# Altium project HIL_RIG_Hardware.PrjPcb (part 1 of 11)
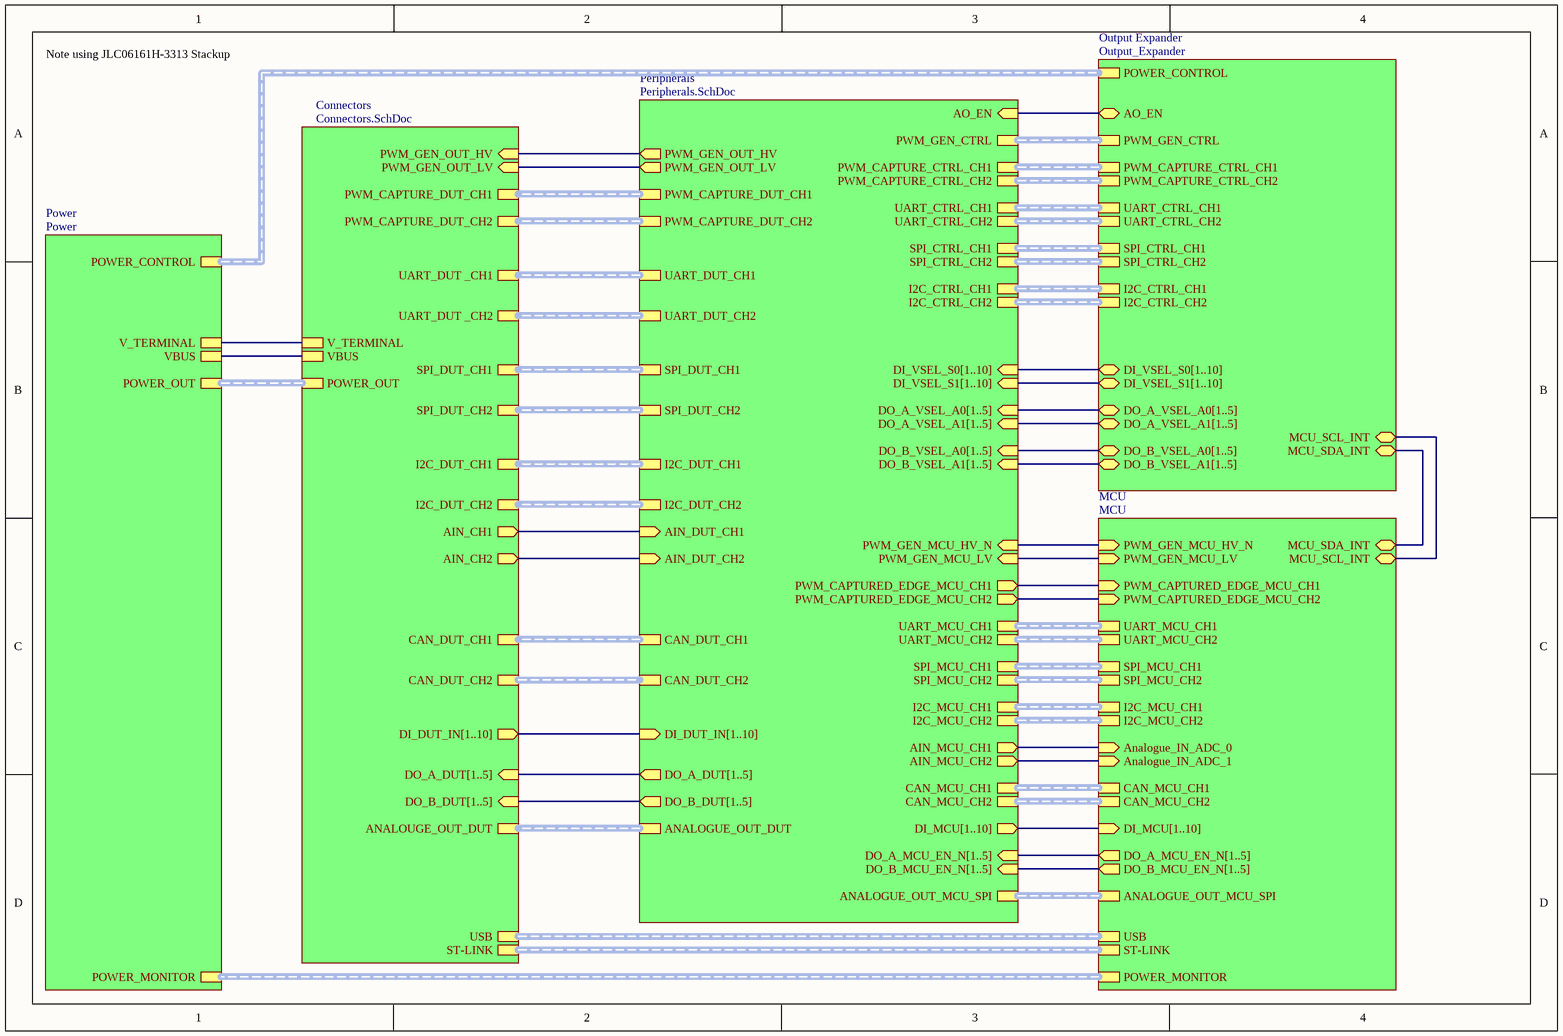
[diagram p0:  Top_Level_HIL_RIG.SchDoc]
29 sheets, 677 parts. Net scope: hierarchical (ports join the sheet entries above them; power ports are global).
Board file:  HIL_RIG_REV_1_2.PcbDoc
Sheets:
   Top_Level_HIL_RIG.SchDoc
   MCU.SchDoc
   PWM_CAPTURE_VREF.SchDoc
   Peripherals.SchDoc
   Digital_Input.SchDoc
   Power.SchDoc
   Digital_Output.SchDoc
   PWM_Input.SchDoc
   PWM_Output.SchDoc
   Analogue_Input.SchDoc
   Analogue_Output.SchDoc
   CAN.SchDoc
   SPI.SchDoc
   UART.SchDoc
   External_Flash.SchDoc
   Connectors.SchDoc
   24V.SchDoc
   12V.SchDoc
   5V.SchDoc
   3V3_Smooth.SchDoc
   3V3_High_Current.SchDoc
   Output_Expander.SchDoc
   I2C.SchDoc
   Output_Expander_IC.SchDoc
   Led_Green_Direct.SchDoc
   LED_Orange_Direct.SchDoc
   LED_Green_Direct_ActiveLow.SchDoc
   LED_RED_Direct_BRIGHT.SchDoc
   LED_Blue_Direct_BRIGHT.SchDoc

## Sheet  Top_Level_HIL_RIG.SchDoc
size A4; SheetNumber: 1; SheetTotal: 29

### Sub-sheets
Connectors = Connectors.SchDoc (file not in this document): V_TERMINAL, VBUS, POWER_OUT (harness Power_Out), PWM_CAPTURE_DUT_CH2 (harness PWM_CAPTURE_DUT_SIGNALS), UART_DUT _CH1 (harness UART_DUT_SIGNALS), CAN_DUT_CH1 (harness CAN_DIFFERENTIAL), CAN_DUT_CH2 (harness CAN_DIFFERENTIAL), DI_DUT_IN[1..10] (out), AIN_CH1 (out), AIN_CH2 (out), SPI_DUT_CH2 (harness SPI_DUT_SIGNALS), SPI_DUT_CH1 (harness SPI_DUT_SIGNALS), I2C_DUT_CH1 (harness I2C_DUT_SIGNALS), I2C_DUT_CH2 (harness I2C_DUT_SIGNALS), UART_DUT _CH2 (harness UART_DUT_SIGNALS), PWM_CAPTURE_DUT_CH1 (harness PWM_CAPTURE_DUT_SIGNALS), PWM_GEN_OUT_LV (in), PWM_GEN_OUT_HV (in), USB (harness USB), ST-LINK (harness ST-LINK), DO_A_DUT[1..5] (in), DO_B_DUT[1..5] (in), ANALOUGE_OUT_DUT (harness ANALOUGE_OUT_DUT_SIGNALS)
MCU = MCU (file not in this document): USB (harness USB), ST-LINK (harness ST-LINK), POWER_MONITOR (harness Power_Monitor), UART_MCU_CH1 (harness UART_MCU_SIGNALS), UART_MCU_CH2 (harness UART_MCU_SIGNALS), DI_MCU[1..10] (in), DO_A_MCU_EN_N[1..5] (out), DO_B_MCU_EN_N[1..5] (out), MCU_SDA_INT (bidir), MCU_SCL_INT (bidir), SPI_MCU_CH1 (harness SPI_MCU_SIGNALS), SPI_MCU_CH2 (harness SPI_MCU_SIGNALS), PWM_GEN_MCU_HV_N (in), PWM_GEN_MCU_LV (in), PWM_CAPTURED_EDGE_MCU_CH1 (in), PWM_CAPTURED_EDGE_MCU_CH2 (in), Analogue_IN_ADC_0 (in), Analogue_IN_ADC_1 (in), CAN_MCU_CH1 (harness CAN_TX_RX), CAN_MCU_CH2 (harness CAN_TX_RX), I2C_MCU_CH1 (harness I2C_MCU_SIGNALS), I2C_MCU_CH2 (harness I2C_MCU_SIGNALS), ANALOGUE_OUT_MCU_SPI (harness ANALOGUE_OUT_MCU_SIGNALS)
Output Expander = Output_Expander (file not in this document): DO_B_VSEL_A1[1..5] (bidir), DO_B_VSEL_A0[1..5] (bidir), DO_A_VSEL_A0[1..5] (bidir), DO_A_VSEL_A1[1..5] (bidir), DI_VSEL_S0[1..10] (bidir), DI_VSEL_S1[1..10] (bidir), PWM_GEN_CTRL (harness PWM_GEN_CTRL_SIGNALS), POWER_CONTROL (harness Power_Ctl), PWM_CAPTURE_CTRL_CH1 (harness PWM_CAPTURE_CTRL_SIGNALS), PWM_CAPTURE_CTRL_CH2 (harness PWM_CAPTURE_CTRL_SIGNALS), MCU_SCL_INT (bidir), MCU_SDA_INT (bidir), SPI_CTRL_CH1 (harness SPI_CTRL_SIGNALS), SPI_CTRL_CH2 (harness SPI_CTRL_SIGNALS), UART_CTRL_CH1 (harness UART_CTRL_SIGNALS), UART_CTRL_CH2 (harness UART_CTRL_SIGNALS), I2C_CTRL_CH1 (harness I2C_CTRL_SIGNALS), I2C_CTRL_CH2 (harness I2C_CTRL_SIGNALS), AO_EN (bidir)
Peripherals = Peripherals.SchDoc (file not in this document): PWM_CAPTURE_DUT_CH2 (harness PWM_CAPTURE_DUT_SIGNALS), UART_DUT_CH1 (harness UART_DUT_SIGNALS), UART_DUT_CH2 (harness UART_DUT_SIGNALS), SPI_DUT_CH2 (harness SPI_DUT_SIGNALS), SPI_DUT_CH1 (harness SPI_DUT_SIGNALS), I2C_DUT_CH2 (harness I2C_DUT_SIGNALS), I2C_DUT_CH1 (harness I2C_DUT_SIGNALS), AIN_DUT_CH1 (in), AIN_DUT_CH2 (in), CAN_DUT_CH1 (harness CAN_DIFFERENTIAL), CAN_DUT_CH2 (harness CAN_DIFFERENTIAL), DI_DUT_IN[1..10] (in), PWM_GEN_CTRL (harness PWM_GEN_CTRL_SIGNALS), PWM_CAPTURE_CTRL_CH1 (harness PWM_CAPTURE_CTRL_SIGNALS), PWM_CAPTURE_CTRL_CH2 (harness PWM_CAPTURE_CTRL_SIGNALS), UART_CTRL_CH1 (harness UART_CTRL_SIGNALS), UART_CTRL_CH2 (harness UART_CTRL_SIGNALS), SPI_CTRL_CH1 (harness SPI_CTRL_SIGNALS), SPI_CTRL_CH2 (harness SPI_CTRL_SIGNALS), I2C_CTRL_CH1 (harness I2C_CTRL_SIGNALS), I2C_CTRL_CH2 (harness I2C_CTRL_SIGNALS), PWM_CAPTURE_DUT_CH1 (harness PWM_CAPTURE_DUT_SIGNALS), PWM_GEN_OUT_LV (out), PWM_GEN_OUT_HV (out), DO_A_DUT[1..5] (out), DO_B_DUT[1..5] (out), CAN_MCU_CH2 (harness CAN_TX_RX), CAN_MCU_CH1 (harness CAN_TX_RX), AIN_MCU_CH2 (out), AIN_MCU_CH1 (out), I2C_MCU_CH2 (harness I2C_MCU_SIGNALS), I2C_MCU_CH1 (harness I2C_MCU_SIGNALS), ANALOGUE_OUT_DUT, AO_EN (in), SPI_MCU_CH2 (harness SPI_MCU_SIGNALS), SPI_MCU_CH1 (harness SPI_MCU_SIGNALS), UART_MCU_CH2 (harness UART_MCU_SIGNALS), UART_MCU_CH1 (harness UART_MCU_SIGNALS), PWM_CAPTURED_EDGE_MCU_CH2 (out), PWM_CAPTURED_EDGE_MCU_CH1 (out), PWM_GEN_MCU_LV (in), PWM_GEN_MCU_HV_N (in), ANALOGUE_OUT_MCU_SPI, DI_VSEL_S0[1..10] (in), DI_VSEL_S1[1..10] (in), DO_A_VSEL_A0[1..5] (in), DO_A_VSEL_A1[1..5] (in), DO_B_VSEL_A0[1..5] (in), DO_B_VSEL_A1[1..5] (in), DI_MCU[1..10] (out), DO_A_MCU_EN_N[1..5] (in), DO_B_MCU_EN_N[1..5] (in)
Power = Power (file not in this document): V_TERMINAL, VBUS, POWER_OUT (harness *), POWER_CONTROL (harness *), POWER_MONITOR (harness *)

### Nets
(unnamed): sheet MCU/MCU_SDA_INT, sheet Output Expander/MCU_SDA_INT
(unnamed): sheet MCU/MCU_SCL_INT, sheet Output Expander/MCU_SCL_INT
(unnamed): sheet MCU/PWM_GEN_MCU_HV_N, sheet Peripherals/PWM_GEN_MCU_HV_N
(unnamed): sheet MCU/PWM_GEN_MCU_LV, sheet Peripherals/PWM_GEN_MCU_LV
(unnamed): sheet MCU/PWM_CAPTURED_EDGE_MCU_CH1, sheet Peripherals/PWM_CAPTURED_EDGE_MCU_CH1
(unnamed): sheet MCU/PWM_CAPTURED_EDGE_MCU_CH2, sheet Peripherals/PWM_CAPTURED_EDGE_MCU_CH2
(unnamed): sheet MCU/Analogue_IN_ADC_0, sheet Peripherals/AIN_MCU_CH1
(unnamed): sheet MCU/Analogue_IN_ADC_1, sheet Peripherals/AIN_MCU_CH2
(unnamed): sheet Power/V_TERMINAL, sheet Connectors/V_TERMINAL
(unnamed): sheet Power/VBUS, sheet Connectors/VBUS
(unnamed): sheet Peripherals/AIN_DUT_CH1, sheet Connectors/AIN_CH1
(unnamed): sheet Peripherals/AIN_DUT_CH2, sheet Connectors/AIN_CH2
(unnamed): sheet Peripherals/PWM_GEN_OUT_LV, sheet Connectors/PWM_GEN_OUT_LV
(unnamed): sheet Peripherals/PWM_GEN_OUT_HV, sheet Connectors/PWM_GEN_OUT_HV
(unnamed): sheet Peripherals/AO_EN, sheet Output Expander/AO_EN

### Buses and harness runs
bus sheet Connectors/DI_DUT_IN[1..10] = sheet Peripherals/DI_DUT_IN[1..10]
bus sheet Connectors/DO_A_DUT[1..5] = sheet Peripherals/DO_A_DUT[1..5]
bus sheet Connectors/DO_B_DUT[1..5] = sheet Peripherals/DO_B_DUT[1..5]
bus sheet MCU/DI_MCU[1..10] = sheet Peripherals/DI_MCU[1..10]
bus sheet MCU/DO_A_MCU_EN_N[1..5] = sheet Peripherals/DO_A_MCU_EN_N[1..5]
bus sheet MCU/DO_B_MCU_EN_N[1..5] = sheet Peripherals/DO_B_MCU_EN_N[1..5]
bus sheet Output Expander/DI_VSEL_S0[1..10] = sheet Peripherals/DI_VSEL_S0[1..10]
bus sheet Output Expander/DI_VSEL_S1[1..10] = sheet Peripherals/DI_VSEL_S1[1..10]
bus sheet Output Expander/DO_A_VSEL_A0[1..5] = sheet Peripherals/DO_A_VSEL_A0[1..5]
bus sheet Output Expander/DO_A_VSEL_A1[1..5] = sheet Peripherals/DO_A_VSEL_A1[1..5]
bus sheet Output Expander/DO_B_VSEL_A0[1..5] = sheet Peripherals/DO_B_VSEL_A0[1..5]
bus sheet Output Expander/DO_B_VSEL_A1[1..5] = sheet Peripherals/DO_B_VSEL_A1[1..5]
harness  = sheet Connectors/ANALOUGE_OUT_DUT = sheet Peripherals/ANALOGUE_OUT_DUT
harness sheet Connectors/CAN_DUT_CH1 = sheet Peripherals/CAN_DUT_CH1
harness sheet Connectors/CAN_DUT_CH2 = sheet Peripherals/CAN_DUT_CH2
harness sheet Connectors/I2C_DUT_CH1 = sheet Peripherals/I2C_DUT_CH1
harness sheet Connectors/I2C_DUT_CH2 = sheet Peripherals/I2C_DUT_CH2
harness sheet Connectors/POWER_OUT = sheet Power/POWER_OUT
harness sheet Connectors/PWM_CAPTURE_DUT_CH1 = sheet Peripherals/PWM_CAPTURE_DUT_CH1
harness sheet Connectors/PWM_CAPTURE_DUT_CH2 = sheet Peripherals/PWM_CAPTURE_DUT_CH2
harness sheet Connectors/SPI_DUT_CH1 = sheet Peripherals/SPI_DUT_CH1
harness sheet Connectors/SPI_DUT_CH2 = sheet Peripherals/SPI_DUT_CH2
harness sheet Connectors/ST-LINK = sheet MCU/ST-LINK
harness sheet Connectors/UART_DUT _CH1 = sheet Peripherals/UART_DUT_CH1
harness sheet Connectors/UART_DUT _CH2 = sheet Peripherals/UART_DUT_CH2
harness sheet Connectors/USB = sheet MCU/USB
harness sheet MCU/ANALOGUE_OUT_MCU_SPI = sheet Peripherals/ANALOGUE_OUT_MCU_SPI
harness sheet MCU/CAN_MCU_CH1 = sheet Peripherals/CAN_MCU_CH1
harness sheet MCU/CAN_MCU_CH2 = sheet Peripherals/CAN_MCU_CH2
harness sheet MCU/I2C_MCU_CH1 = sheet Peripherals/I2C_MCU_CH1
harness sheet MCU/I2C_MCU_CH2 = sheet Peripherals/I2C_MCU_CH2
harness sheet MCU/POWER_MONITOR = sheet Power/POWER_MONITOR
harness sheet MCU/SPI_MCU_CH1 = sheet Peripherals/SPI_MCU_CH1
harness sheet MCU/SPI_MCU_CH2 = sheet Peripherals/SPI_MCU_CH2
harness sheet MCU/UART_MCU_CH1 = sheet Peripherals/UART_MCU_CH1
harness sheet MCU/UART_MCU_CH2 = sheet Peripherals/UART_MCU_CH2
harness sheet Output Expander/I2C_CTRL_CH1 = sheet Peripherals/I2C_CTRL_CH1
harness sheet Output Expander/I2C_CTRL_CH2 = sheet Peripherals/I2C_CTRL_CH2
harness sheet Output Expander/POWER_CONTROL = sheet Power/POWER_CONTROL
harness sheet Output Expander/PWM_CAPTURE_CTRL_CH1 = sheet Peripherals/PWM_CAPTURE_CTRL_CH1
harness sheet Output Expander/PWM_CAPTURE_CTRL_CH2 = sheet Peripherals/PWM_CAPTURE_CTRL_CH2
harness sheet Output Expander/PWM_GEN_CTRL = sheet Peripherals/PWM_GEN_CTRL
harness sheet Output Expander/SPI_CTRL_CH1 = sheet Peripherals/SPI_CTRL_CH1
harness sheet Output Expander/SPI_CTRL_CH2 = sheet Peripherals/SPI_CTRL_CH2
harness sheet Output Expander/UART_CTRL_CH1 = sheet Peripherals/UART_CTRL_CH1
harness sheet Output Expander/UART_CTRL_CH2 = sheet Peripherals/UART_CTRL_CH2

### Notes on the sheet
- Note using JLC06161H-3313 Stackup

## Sheet  MCU.SchDoc
size A2; SheetNumber: 2; SheetTotal: 29
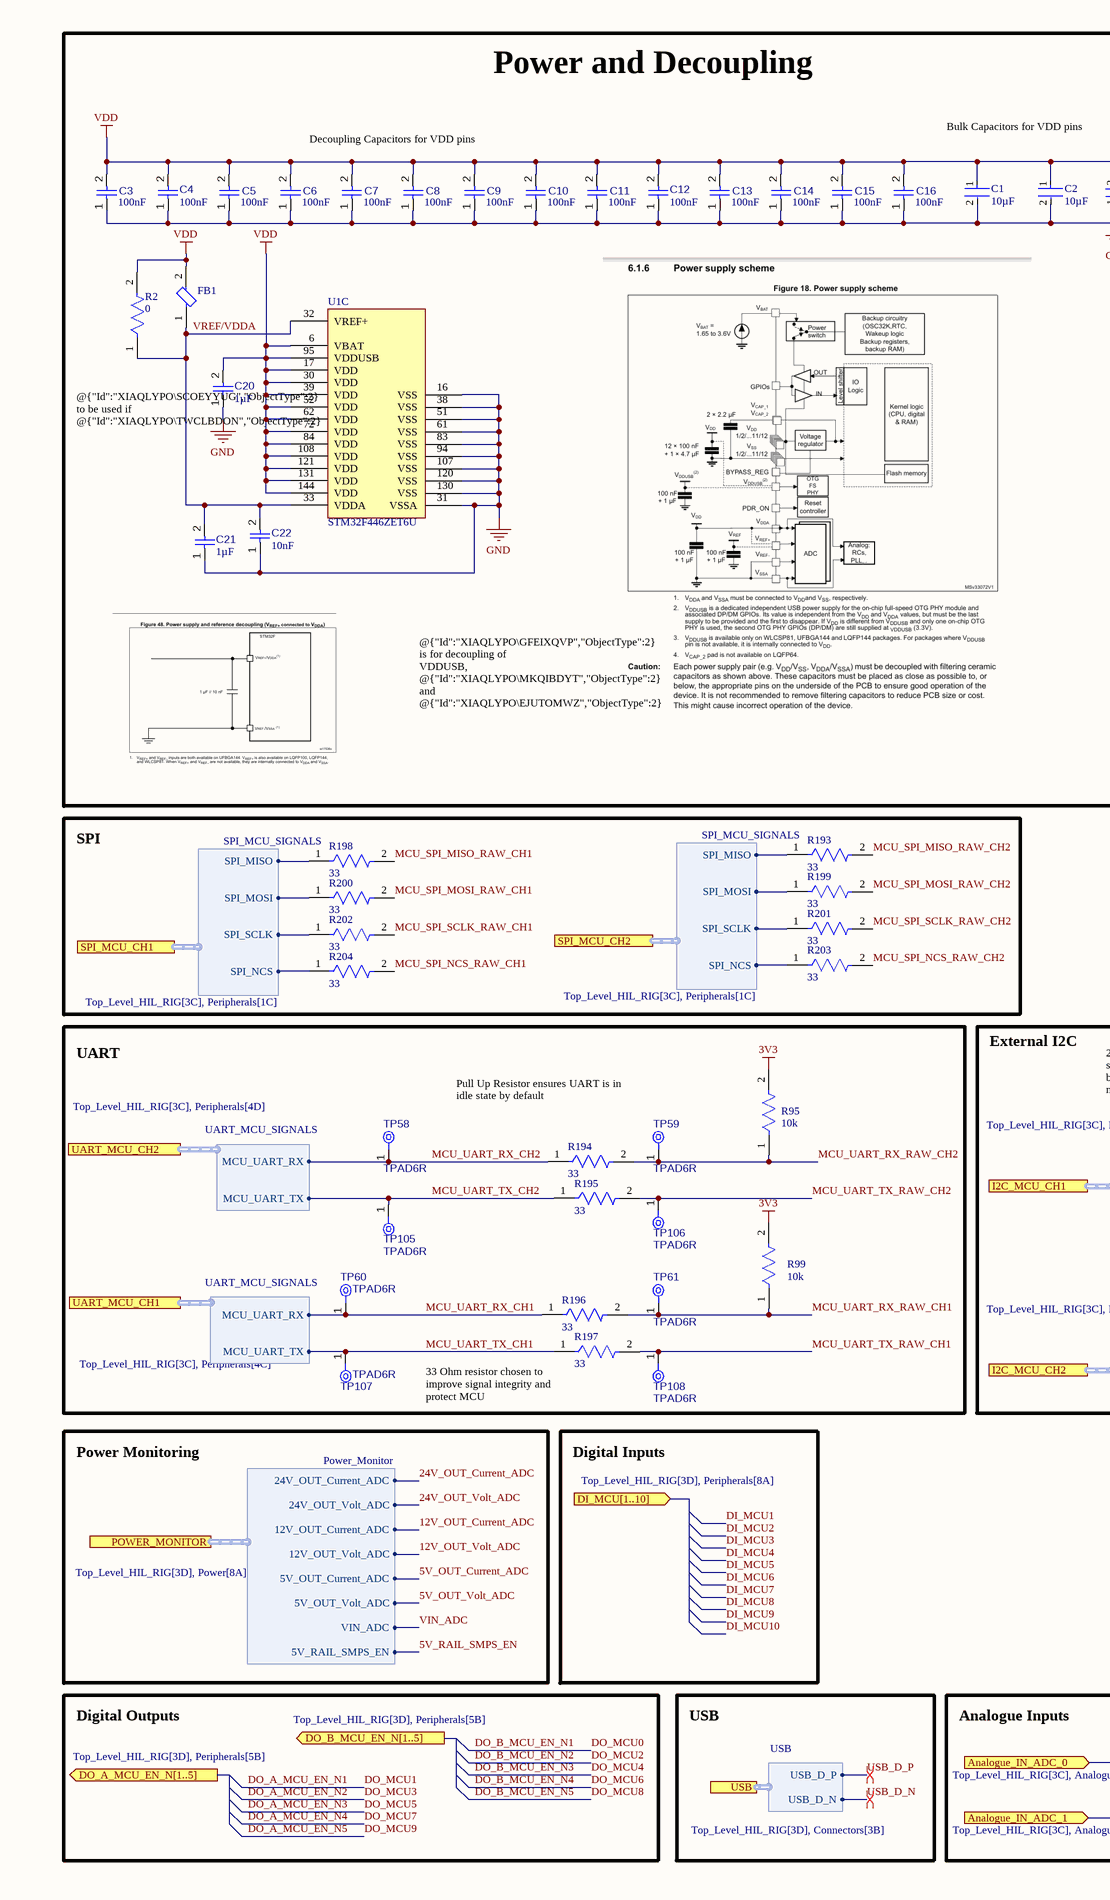
[diagram p1:  MCU.SchDoc, left]
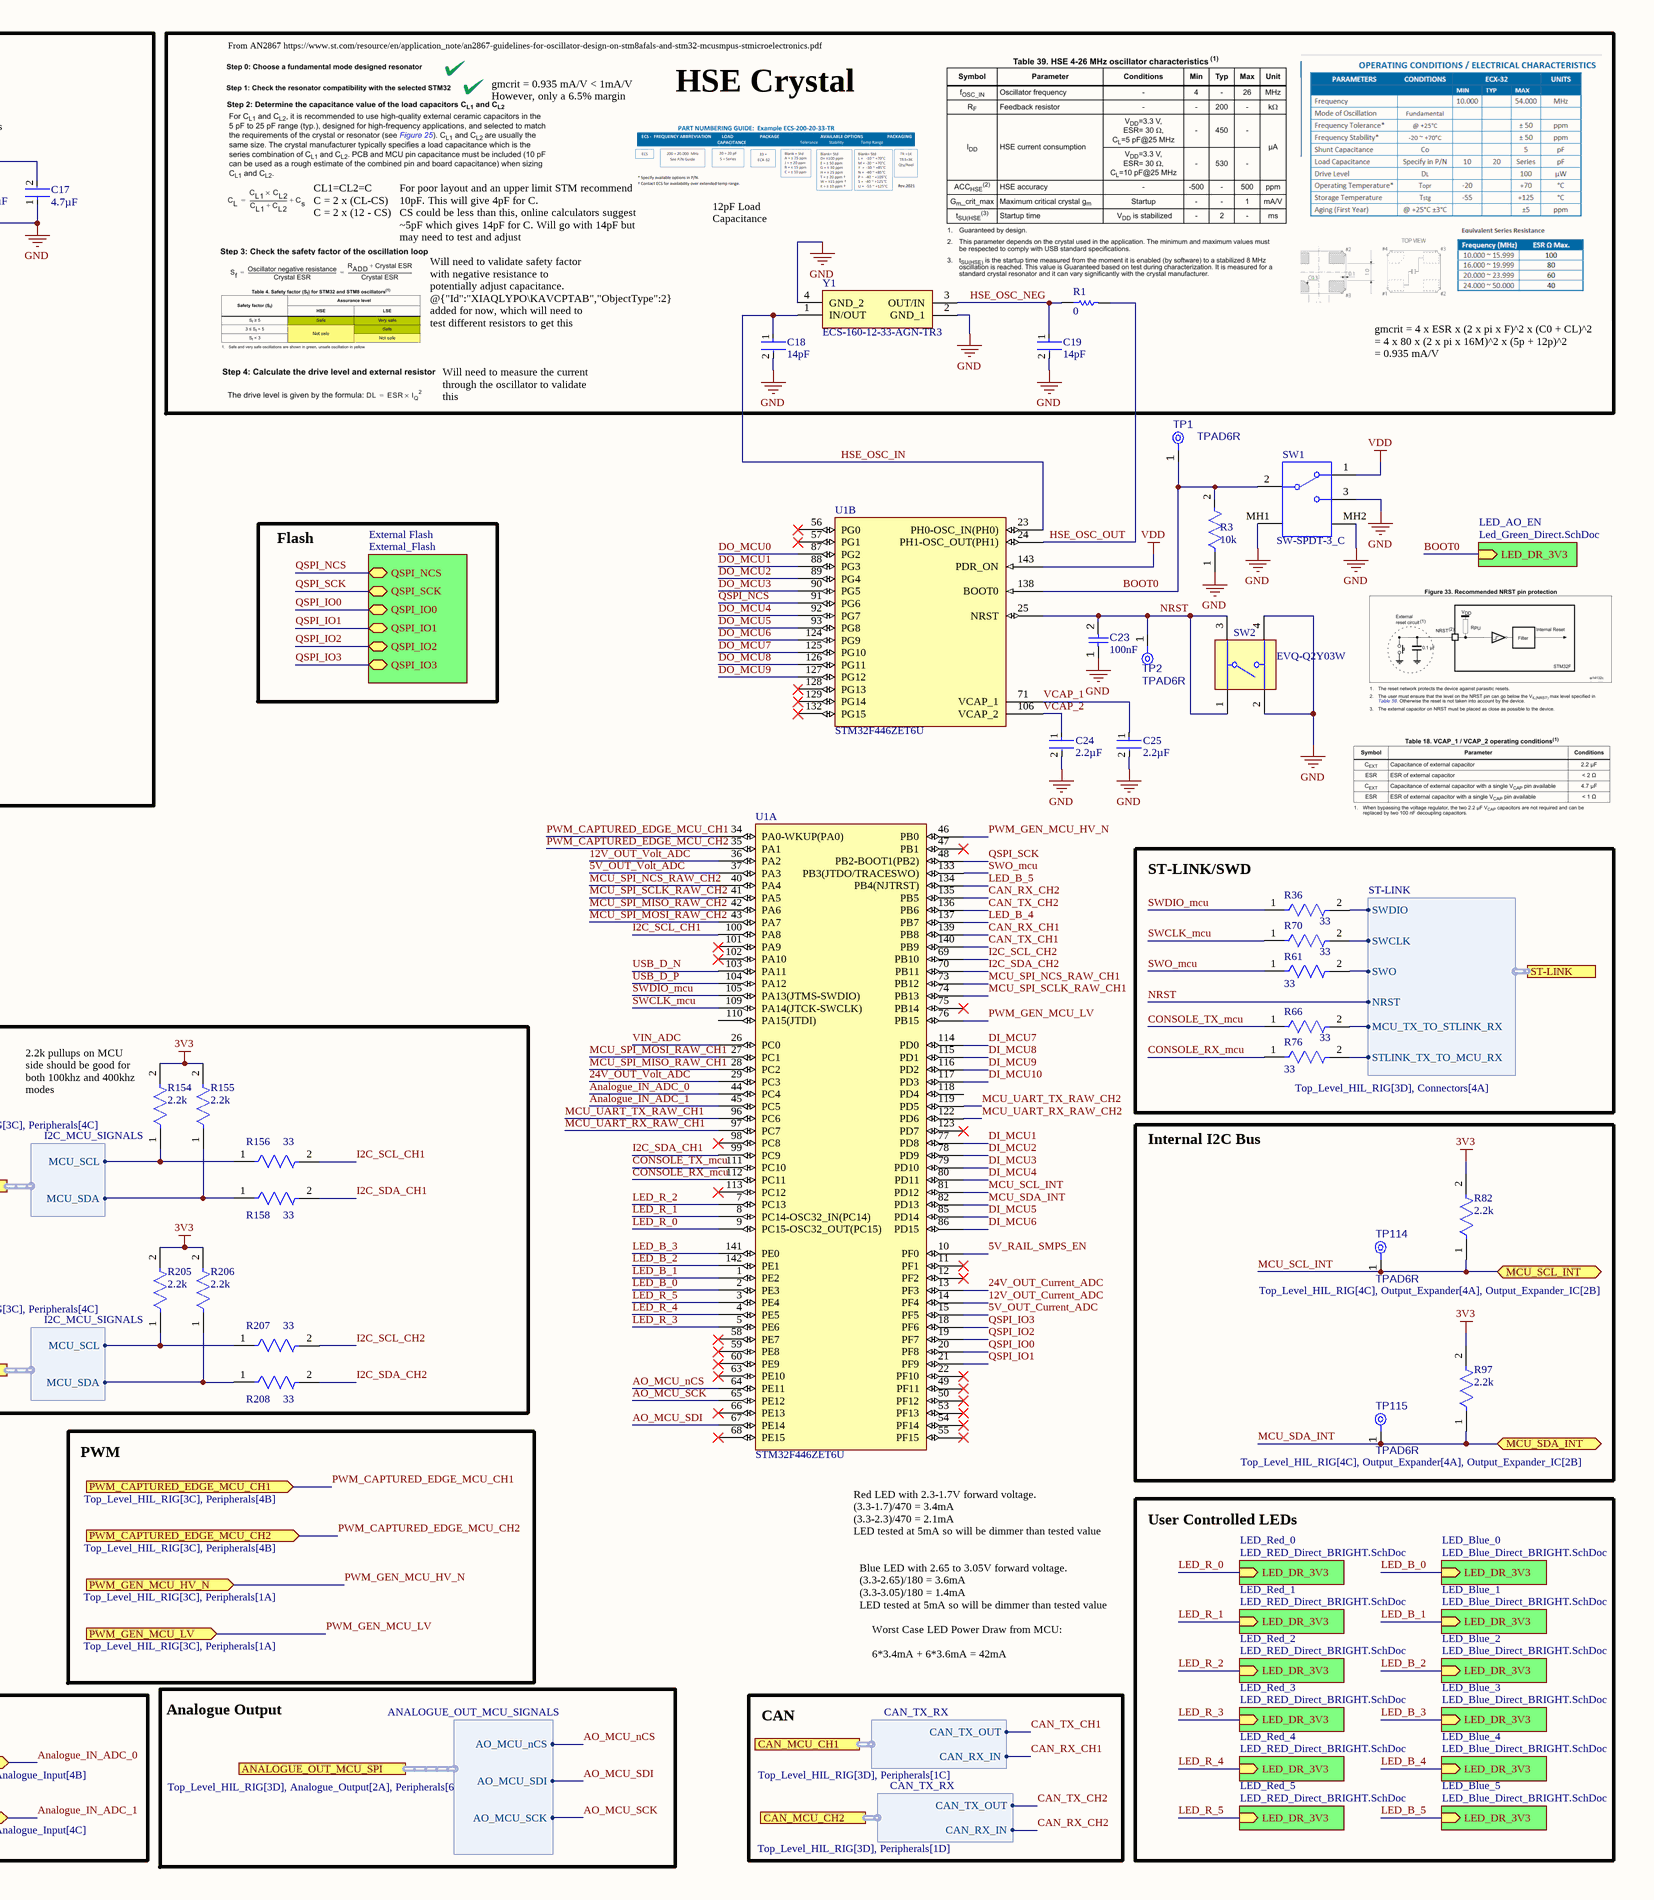
[diagram p2:  MCU.SchDoc, right]

### Parts
C1  value 10µF  [FP-GRM31C-0_2-e0_3_0_8-IPC_C]  (hidden comment: GRM31CR71E106KA12L)
C2  value 10µF  [FP-GRM31C-0_2-e0_3_0_8-IPC_C]  (hidden comment: GRM31CR71E106KA12L)
C3  value 100nF  [CAPC1005X55X25ML05T10]  (hidden comment: GRM155R71A104KA01D)
C4  value 100nF  [CAPC1005X55X25ML05T10]  (hidden comment: GRM155R71A104KA01D)
C5  value 100nF  [CAPC1005X55X25ML05T10]  (hidden comment: GRM155R71A104KA01D)
C6  value 100nF  [CAPC1005X55X25ML05T10]  (hidden comment: GRM155R71A104KA01D)
C7  value 100nF  [CAPC1005X55X25ML05T10]  (hidden comment: GRM155R71A104KA01D)
C8  value 100nF  [CAPC1005X55X25ML05T10]  (hidden comment: GRM155R71A104KA01D)
C9  value 100nF  [CAPC1005X55X25ML05T10]  (hidden comment: GRM155R71A104KA01D)
C10  value 100nF  [CAPC1005X55X25ML05T10]  (hidden comment: GRM155R71A104KA01D)
C11  value 100nF  [CAPC1005X55X25ML05T10]  (hidden comment: GRM155R71A104KA01D)
C12  value 100nF  [CAPC1005X55X25ML05T10]  (hidden comment: GRM155R71A104KA01D)
C13  value 100nF  [CAPC1005X55X25ML05T10]  (hidden comment: GRM155R71A104KA01D)
C14  value 100nF  [CAPC1005X55X25ML05T10]  (hidden comment: GRM155R71A104KA01D)
C15  value 100nF  [CAPC1005X55X25ML05T10]  (hidden comment: GRM155R71A104KA01D)
C16  value 100nF  [CAPC1005X55X25ML05T10]  (hidden comment: GRM155R71A104KA01D)
C17  value 4.7µF  [FP-GRM21B-0_2-e0_2_0_7-MFG]  (hidden comment: GRM21BZ71H475KE15L)
C18  value 14pF  [FP-GJM155-0_05-IPC_A]  (hidden comment: GJM1555C1H140FB01D)
C19  value 14pF  [FP-GJM155-0_05-IPC_A]  (hidden comment: GJM1555C1H140FB01D)
C20  value 1µF  [CAPC1608X90X40LL10T20]  (hidden comment: Capacitor 1 uF +/- 10% 25 V 0603)
C21  value 1µF  [CAPC1608X90X40LL10T20]  (hidden comment: Capacitor 1 uF +/- 10% 25 V 0603)
C22  value 10nF  [CAPC0402(1005)60_L]  (hidden comment: Capacitor 10nF +/-20% 50V 0402)
C23  value 100nF  [CAPC1005X55X25ML05T10]  (hidden comment: GRM155R71A104KA01D)
C24  value 2.2µF  [FP-CC0402-IPC_A]  (hidden comment: CC0402KRX5R6BB225)
C25  value 2.2µF  [FP-CC0402-IPC_A]  (hidden comment: CC0402KRX5R6BB225)
FB1  BLM15AG121SH1D  [FP-BLM15-0_05-IPC_A]  (value not drawn)
R1  value 0  [RESC1608X55X25ML10T15]  (hidden comment: Resistor 0R +/- 5% 0603 100 mW)
R2  value 0  [FP-MCS0402-IPC_B]  (hidden comment: MCS04020Z0000ZE000)
R3  value 10k  [FP-RT0603-IPC_C]  (hidden comment: RT0603BRD0710KL)
R36  value 33  [FP-AC0603-IPC_C]  (hidden comment: AC0603FR-0733RL)
R61  value 33  [FP-AC0603-IPC_C]  (hidden comment: AC0603FR-0733RL)
R66  value 33  [FP-AC0603-IPC_C]  (hidden comment: AC0603FR-0733RL)
R70  value 33  [FP-AC0603-IPC_C]  (hidden comment: AC0603FR-0733RL)
R76  value 33  [FP-AC0603-IPC_C]  (hidden comment: AC0603FR-0733RL)
R82  value 2.2k  [FP-RT0603-IPC_C]  (hidden comment: RT0603BRD072K2L)
R95  value 10k  [FP-RT0603-IPC_C]  (hidden comment: RT0603BRD0710KL)
R97  value 2.2k  [FP-RT0603-IPC_C]  (hidden comment: RT0603BRD072K2L)
R99  value 10k  [FP-RT0603-IPC_C]  (hidden comment: RT0603BRD0710KL)
R154  value 2.2k  [FP-RT0603-IPC_C]  (hidden comment: RT0603BRD072K2L)
R155  value 2.2k  [FP-RT0603-IPC_C]  (hidden comment: RT0603BRD072K2L)
R156  value 33  [FP-AC0603-IPC_C]  (hidden comment: AC0603FR-0733RL)
R158  value 33  [FP-AC0603-IPC_C]  (hidden comment: AC0603FR-0733RL)
R193  value 33  [FP-AC0603-IPC_C]  (hidden comment: AC0603FR-0733RL)
R194  value 33  [FP-AC0603-IPC_C]  (hidden comment: AC0603FR-0733RL)
R195  value 33  [FP-AC0603-IPC_C]  (hidden comment: AC0603FR-0733RL)
R196  value 33  [FP-AC0603-IPC_C]  (hidden comment: AC0603FR-0733RL)
R197  value 33  [FP-AC0603-IPC_C]  (hidden comment: AC0603FR-0733RL)
R198  value 33  [FP-AC0603-IPC_C]  (hidden comment: AC0603FR-0733RL)
R199  value 33  [FP-AC0603-IPC_C]  (hidden comment: AC0603FR-0733RL)
R200  value 33  [FP-AC0603-IPC_C]  (hidden comment: AC0603FR-0733RL)
R201  value 33  [FP-AC0603-IPC_C]  (hidden comment: AC0603FR-0733RL)
R202  value 33  [FP-AC0603-IPC_C]  (hidden comment: AC0603FR-0733RL)
R203  value 33  [FP-AC0603-IPC_C]  (hidden comment: AC0603FR-0733RL)
R204  value 33  [FP-AC0603-IPC_C]  (hidden comment: AC0603FR-0733RL)
R205  value 2.2k  [FP-RT0603-IPC_C]  (hidden comment: RT0603BRD072K2L)
R206  value 2.2k  [FP-RT0603-IPC_C]  (hidden comment: RT0603BRD072K2L)
R207  value 33  [FP-AC0603-IPC_C]  (hidden comment: AC0603FR-0733RL)
R208  value 33  [FP-AC0603-IPC_C]  (hidden comment: AC0603FR-0733RL)
SW1  SW-SPDT-3_C  [SS12F44G5]
SW2  EVQ-Q2Y03W  [PNSC-EVQQ2_V]
TP1  TPAD6R  [TP06R]  (no BOM)
TP2  TPAD6R  [TP06R]  (no BOM)
TP58  TPAD6R  [TP06R]  (no BOM)
TP59  TPAD6R  [TP06R]  (no BOM)
TP60  TPAD6R  [TP06R]  (no BOM)
TP61  TPAD6R  [TP06R]  (no BOM)
TP105  TPAD6R  [TP06R]  (no BOM)
TP106  TPAD6R  [TP06R]  (no BOM)
TP107  TPAD6R  [TP06R]  (no BOM)
TP108  TPAD6R  [TP06R]  (no BOM)
TP114  TPAD6R  [TP06R]  (no BOM)
TP115  TPAD6R  [TP06R]  (no BOM)
U1  STM32F446ZET6U  [STM-LQFP144_N]  (parts A,B,C of 3)
Y1  ECS-160-12-33-AGN-TR3  [ECS1601233AGNTR3]

### Blocks framed on the sheet
Power and Decoupling: C1-C17 C20-C22 FB1 R2 U1
HSE Crystal: C18 C19 R1 Y1
SPI: R193 R198-R204
ST-LINK/SWD: R36 R61 R66 R70 R76
UART: R95 R99 R194-R197 TP58-TP61 TP105-TP108
External I2C: R154-R156 R158 R205-R208
Internal I2C Bus: R82 R97 TP114 TP115

### Sub-sheets
External Flash = External_Flash (file not in this document): QSPI_NCS (bidir), QSPI_IO0 (bidir), QSPI_IO1 (bidir), QSPI_IO2 (bidir), QSPI_IO3 (bidir), QSPI_SCK (bidir)
LED_AO_EN = Led_Green_Direct.SchDoc (file not in this document): LED_DR_3V3 (in)
LED_Blue_0 = LED_Blue_Direct_BRIGHT.SchDoc (file not in this document): LED_DR_3V3 (in)
LED_Blue_1 = LED_Blue_Direct_BRIGHT.SchDoc (file not in this document): LED_DR_3V3 (in)
LED_Blue_2 = LED_Blue_Direct_BRIGHT.SchDoc (file not in this document): LED_DR_3V3 (in)
LED_Blue_3 = LED_Blue_Direct_BRIGHT.SchDoc (file not in this document): LED_DR_3V3 (in)
LED_Blue_4 = LED_Blue_Direct_BRIGHT.SchDoc (file not in this document): LED_DR_3V3 (in)
LED_Blue_5 = LED_Blue_Direct_BRIGHT.SchDoc (file not in this document): LED_DR_3V3 (in)
LED_Red_0 = LED_RED_Direct_BRIGHT.SchDoc (file not in this document): LED_DR_3V3 (in)
LED_Red_1 = LED_RED_Direct_BRIGHT.SchDoc (file not in this document): LED_DR_3V3 (in)
LED_Red_2 = LED_RED_Direct_BRIGHT.SchDoc (file not in this document): LED_DR_3V3 (in)
LED_Red_3 = LED_RED_Direct_BRIGHT.SchDoc (file not in this document): LED_DR_3V3 (in)
LED_Red_4 = LED_RED_Direct_BRIGHT.SchDoc (file not in this document): LED_DR_3V3 (in)
LED_Red_5 = LED_RED_Direct_BRIGHT.SchDoc (file not in this document): LED_DR_3V3 (in)

### Ports
Analogue_IN_ADC_0 (in, see Top_Level_HIL_RIG[3C], Analogue_Input[4B]), Analogue_IN_ADC_1 (in, see Top_Level_HIL_RIG[3C], Analogue_Input[4C]), ANALOGUE_OUT_MCU_SPI (harness ANALOGUE_OUT_MCU_SIGNALS, see Top_Level_HIL_RIG[3D], Analogue_Output[2A], Peripherals[6D]), CAN_MCU_CH1 (harness CAN_TX_RX, see Top_Level_HIL_RIG[3D], Peripherals[1C]), CAN_MCU_CH2 (harness CAN_TX_RX, see Top_Level_HIL_RIG[3D], Peripherals[1D]), DI_MCU[1..10] (in, see Top_Level_HIL_RIG[3D], Peripherals[8A]), DO_A_MCU_EN_N[1..5] (out, see Top_Level_HIL_RIG[3D], Peripherals[5B]), DO_B_MCU_EN_N[1..5] (out, see Top_Level_HIL_RIG[3D], Peripherals[5B]), I2C_MCU_CH1 (harness I2C_MCU_SIGNALS, see Top_Level_HIL_RIG[3C], Peripherals[4C]), I2C_MCU_CH2 (harness I2C_MCU_SIGNALS, see Top_Level_HIL_RIG[3C], Peripherals[4C]), MCU_SCL_INT (bidir, see Top_Level_HIL_RIG[4C], Output_Expander[4A], Output_Expander_IC[2B]), MCU_SDA_INT (bidir, see Top_Level_HIL_RIG[4C], Output_Expander[4A], Output_Expander_IC[2B]), POWER_MONITOR (harness Power_Monitor, see Top_Level_HIL_RIG[3D], Power[8A]), PWM_CAPTURED_EDGE_MCU_CH1 (in, see Top_Level_HIL_RIG[3C], Peripherals[4B]), PWM_CAPTURED_EDGE_MCU_CH2 (in, see Top_Level_HIL_RIG[3C], Peripherals[4B]), PWM_GEN_MCU_HV_N (in, see Top_Level_HIL_RIG[3C], Peripherals[1A]), PWM_GEN_MCU_LV (in, see Top_Level_HIL_RIG[3C], Peripherals[1A]), SPI_MCU_CH1 (harness SPI_MCU_SIGNALS, see Top_Level_HIL_RIG[3C], Peripherals[1C]), SPI_MCU_CH2 (harness SPI_MCU_SIGNALS, see Top_Level_HIL_RIG[3C], Peripherals[1C]), ST-LINK (harness ST-LINK, see Top_Level_HIL_RIG[3D], Connectors[4A]), UART_MCU_CH1 (harness UART_MCU_SIGNALS, see Top_Level_HIL_RIG[3C], Peripherals[4C]), UART_MCU_CH2 (harness UART_MCU_SIGNALS, see Top_Level_HIL_RIG[3C], Peripherals[4D]), USB (harness USB, see Top_Level_HIL_RIG[3D], Connectors[3B])

### Harnesses
ST-LINK: STLINK_TX_TO_MCU_RX, MCU_TX_TO_STLINK_RX, SWO, NRST, SWCLK, SWDIO
USB: USB_D_P, USB_D_N
Power_Monitor: 24V_OUT_Current_ADC, 24V_OUT_Volt_ADC, 12V_OUT_Current_ADC, 5V_OUT_Current_ADC, 5V_OUT_Volt_ADC, VIN_ADC, 5V_RAIL_SMPS_EN, 12V_OUT_Volt_ADC
UART_MCU_SIGNALS: MCU_UART_RX, MCU_UART_TX
SPI_MCU_SIGNALS: SPI_MISO, SPI_MOSI, SPI_SCLK, SPI_NCS
CAN_TX_RX: CAN_TX_OUT, CAN_RX_IN
I2C_MCU_SIGNALS: MCU_SCL, MCU_SDA
ANALOGUE_OUT_MCU_SIGNALS: AO_MCU_nCS, AO_MCU_SDI, AO_MCU_SCK

### Nets
3V3: R82.2 R95.2 R97.2 R99.2 R154.2 R155.2 R205.2 R206.2
GND: C1.2 C2.2 C3.1 C4.1 C5.1 C6.1 C7.1 C8.1 C9.1 C10.1 C11.1 C12.1 C13.1 C14.1 C15.1 C16.1 C17.1 C18.2 C19.2 C20.1 C21.1 C22.1 C23.1 C24.2 C25.2 R3.1 SW1.3 SW1.MH1 SW1.MH2 SW2.2(B) SW2.4(B') U1.16(VSS) U1.31(VSSA) U1.38(VSS) U1.51(VSS) U1.61(VSS) U1.83(VSS) U1.94(VSS) U1.107(VSS) U1.120(VSS) U1.130(VSS) Y1.2(GND_1) Y1.4(GND_2)
VDD: C1.1 C2.1 C3.2 C4.2 C5.2 C6.2 C7.2 C8.2 C9.2 C10.2 C11.2 C12.2 C13.2 C14.2 C15.2 C16.2 C17.2 C20.2 FB1.2 R2.2 SW1.1 U1.6(VBAT) U1.17(VDD) U1.30(VDD) U1.39(VDD) U1.52(VDD) U1.62(VDD) U1.72(VDD) U1.84(VDD) U1.95(VDDUSB) U1.108(VDD) U1.121(VDD) U1.131(VDD) U1.143(PDR_ON) U1.144(VDD)
5V_OUT_Current_ADC: U1.15(PF5) ; port POWER_MONITOR.5V_OUT_Current_ADC
5V_OUT_Volt_ADC: U1.37(PA3) ; port POWER_MONITOR.5V_OUT_Volt_ADC
5V_RAIL_SMPS_EN: U1.10(PF0) ; port POWER_MONITOR.5V_RAIL_SMPS_EN
12V_OUT_Current_ADC: U1.14(PF4) ; port POWER_MONITOR.12V_OUT_Current_ADC
12V_OUT_Volt_ADC: U1.36(PA2) ; port POWER_MONITOR.12V_OUT_Volt_ADC
24V_OUT_Current_ADC: U1.13(PF3) ; port POWER_MONITOR.24V_OUT_Current_ADC
24V_OUT_Volt_ADC: U1.29(PC3) ; port POWER_MONITOR.24V_OUT_Volt_ADC
Analogue_IN_ADC_0: U1.44(PC4) ; port Analogue_IN_ADC_0
Analogue_IN_ADC_1: U1.45(PC5) ; port Analogue_IN_ADC_1
AO_MCU_nCS: U1.64(PE11) ; port ANALOGUE_OUT_MCU_SPI.AO_MCU_nCS
AO_MCU_SCK: U1.65(PE12) ; port ANALOGUE_OUT_MCU_SPI.AO_MCU_SCK
AO_MCU_SDI: U1.67(PE14) ; port ANALOGUE_OUT_MCU_SPI.AO_MCU_SDI
BOOT0: R3.2 SW1.2 TP1.1(TP) U1.138(BOOT0) ; sheet LED_AO_EN/LED_DR_3V3
CAN_RX_CH1: U1.139(PB8) ; port CAN_MCU_CH1.CAN_RX_IN
CAN_RX_CH2: U1.135(PB5) ; port CAN_MCU_CH2.CAN_RX_IN
CAN_TX_CH1: U1.140(PB9) ; port CAN_MCU_CH1.CAN_TX_OUT
CAN_TX_CH2: U1.136(PB6) ; port CAN_MCU_CH2.CAN_TX_OUT
CONSOLE_RX_mcu: R76.1 U1.112(PC11)
CONSOLE_TX_mcu: R66.1 U1.111(PC10)
DI_MCU1: U1.77(PD8)
DI_MCU2: U1.78(PD9)
DI_MCU3: U1.79(PD10)
DI_MCU4: U1.80(PD11)
DI_MCU5: U1.85(PD14)
DI_MCU6: U1.86(PD15)
DI_MCU7: U1.114(PD0)
DI_MCU8: U1.115(PD1)
DI_MCU9: U1.116(PD2)
DI_MCU10: U1.117(PD3)
DO_A_MCU_EN_N1: U1.88(PG3)  [also labelled DO_MCU1]
DO_A_MCU_EN_N2: U1.90(PG5)  [also labelled DO_MCU3]
DO_A_MCU_EN_N3: U1.93(PG8)  [also labelled DO_MCU5]
DO_A_MCU_EN_N4: U1.125(PG10)  [also labelled DO_MCU7]
DO_A_MCU_EN_N5: U1.127(PG12)  [also labelled DO_MCU9]
DO_B_MCU_EN_N1: U1.87(PG2)  [also labelled DO_MCU0]
DO_B_MCU_EN_N2: U1.89(PG4)  [also labelled DO_MCU2]
DO_B_MCU_EN_N3: U1.92(PG7)  [also labelled DO_MCU4]
DO_B_MCU_EN_N4: U1.124(PG9)  [also labelled DO_MCU6]
DO_B_MCU_EN_N5: U1.126(PG11)  [also labelled DO_MCU8]
HSE_OSC_IN: C18.1 U1.23(PH0-OSC_IN(PH0)) Y1.1(IN/OUT)
HSE_OSC_NEG: C19.1 R1.1 Y1.3(OUT/IN)
HSE_OSC_OUT: R1.2 U1.24(PH1-OSC_OUT(PH1))
I2C_SCL_CH1: R156.2 U1.100(PA8)
I2C_SCL_CH2: R207.2 U1.69(PB10)
I2C_SDA_CH1: R158.2 U1.99(PC9)
I2C_SDA_CH2: R208.2 U1.70(PB11)
LED_B_0: U1.2(PE3) ; sheet LED_Blue_0/LED_DR_3V3
LED_B_1: U1.1(PE2) ; sheet LED_Blue_1/LED_DR_3V3
LED_B_2: U1.142(PE1) ; sheet LED_Blue_2/LED_DR_3V3
LED_B_3: U1.141(PE0) ; sheet LED_Blue_3/LED_DR_3V3
LED_B_4: U1.137(PB7) ; sheet LED_Blue_4/LED_DR_3V3
LED_B_5: U1.134(PB4(NJTRST)) ; sheet LED_Blue_5/LED_DR_3V3
LED_R_0: U1.9(PC15-OSC32_OUT(PC15)) ; sheet LED_Red_0/LED_DR_3V3
LED_R_1: U1.8(PC14-OSC32_IN(PC14)) ; sheet LED_Red_1/LED_DR_3V3
LED_R_2: U1.7(PC13) ; sheet LED_Red_2/LED_DR_3V3
LED_R_3: U1.5(PE6) ; sheet LED_Red_3/LED_DR_3V3
LED_R_4: U1.4(PE5) ; sheet LED_Red_4/LED_DR_3V3
LED_R_5: U1.3(PE4) ; sheet LED_Red_5/LED_DR_3V3
MCU_SCL_INT: R82.1 TP114.1(TP) U1.81(PD12) ; port MCU_SCL_INT
MCU_SDA_INT: R97.1 TP115.1(TP) U1.82(PD13) ; port MCU_SDA_INT
MCU_SPI_MISO_RAW_CH1: R198.2 U1.28(PC2)
MCU_SPI_MISO_RAW_CH2: R193.2 U1.42(PA6)
MCU_SPI_MOSI_RAW_CH1: R200.2 U1.27(PC1)
MCU_SPI_MOSI_RAW_CH2: R199.2 U1.43(PA7)
MCU_SPI_NCS_RAW_CH1: R204.2 U1.73(PB12)
MCU_SPI_NCS_RAW_CH2: R203.2 U1.40(PA4)
MCU_SPI_SCLK_RAW_CH1: R202.2 U1.74(PB13)
MCU_SPI_SCLK_RAW_CH2: R201.2 U1.41(PA5)
MCU_UART_RX_CH1: R196.1 TP60.1(TP) ; port UART_MCU_CH1.MCU_UART_RX
MCU_UART_RX_CH2: R194.1 TP58.1(TP) ; port UART_MCU_CH2.MCU_UART_RX
MCU_UART_RX_RAW_CH1: R99.1 R196.2 TP61.1(TP) U1.97(PC7)
MCU_UART_RX_RAW_CH2: R95.1 R194.2 TP59.1(TP) U1.122(PD6)
MCU_UART_TX_CH1: R197.1 TP107.1(TP) ; port UART_MCU_CH1.MCU_UART_TX
MCU_UART_TX_CH2: R195.1 TP105.1(TP) ; port UART_MCU_CH2.MCU_UART_TX
MCU_UART_TX_RAW_CH1: R197.2 TP108.1(TP) U1.96(PC6)
MCU_UART_TX_RAW_CH2: R195.2 TP106.1(TP) U1.119(PD5)
NRST: C23.2 SW2.1(A) SW2.3(A') TP2.1(TP) U1.25(NRST) ; port ST-LINK.NRST
PWM_CAPTURED_EDGE_MCU_CH1: U1.34(PA0-WKUP(PA0)) ; port PWM_CAPTURED_EDGE_MCU_CH1
PWM_CAPTURED_EDGE_MCU_CH2: U1.35(PA1) ; port PWM_CAPTURED_EDGE_MCU_CH2
PWM_GEN_MCU_HV_N: U1.46(PB0) ; port PWM_GEN_MCU_HV_N
PWM_GEN_MCU_LV: U1.76(PB15) ; port PWM_GEN_MCU_LV
QSPI_IO0: U1.20(PF8) ; sheet External Flash/QSPI_IO0
QSPI_IO1: U1.21(PF9) ; sheet External Flash/QSPI_IO1
QSPI_IO2: U1.19(PF7) ; sheet External Flash/QSPI_IO2
QSPI_IO3: U1.18(PF6) ; sheet External Flash/QSPI_IO3
QSPI_NCS: U1.91(PG6) ; sheet External Flash/QSPI_NCS
QSPI_SCK: U1.48(PB2-BOOT1(PB2)) ; sheet External Flash/QSPI_SCK
SWCLK_mcu: R70.1 U1.109(PA14(JTCK-SWCLK))
SWDIO_mcu: R36.1 U1.105(PA13(JTMS-SWDIO))
SWO_mcu: R61.1 U1.133(PB3(JTDO/TRACESWO))
USB_D_N: U1.103(PA11) ; port USB.USB_D_N
USB_D_P: U1.104(PA12) ; port USB.USB_D_P
VCAP_1: C25.1 U1.71(VCAP_1)
VCAP_2: C24.1 U1.106(VCAP_2)
VIN_ADC: U1.26(PC0) ; port POWER_MONITOR.VIN_ADC
VREF/VDDA: C21.2 C22.2 FB1.1 R2.1 U1.32(VREF+) U1.33(VDDA)
NetR36_2: R36.2 ; port ST-LINK.SWDIO
NetR61_2: R61.2 ; port ST-LINK.SWO
NetR66_2: R66.2 ; port ST-LINK.MCU_TX_TO_STLINK_RX
NetR70_2: R70.2 ; port ST-LINK.SWCLK
NetR76_2: R76.2 ; port ST-LINK.STLINK_TX_TO_MCU_RX
NetR154_1: R154.1 R156.1 ; port I2C_MCU_CH1.MCU_SCL
NetR155_1: R155.1 R158.1 ; port I2C_MCU_CH1.MCU_SDA
NetR193_1: R193.1 ; port SPI_MCU_CH2.SPI_MISO
NetR198_1: R198.1 ; port SPI_MCU_CH1.SPI_MISO
NetR199_1: R199.1 ; port SPI_MCU_CH2.SPI_MOSI
NetR200_1: R200.1 ; port SPI_MCU_CH1.SPI_MOSI
NetR201_1: R201.1 ; port SPI_MCU_CH2.SPI_SCLK
NetR202_1: R202.1 ; port SPI_MCU_CH1.SPI_SCLK
NetR203_1: R203.1 ; port SPI_MCU_CH2.SPI_NCS
NetR204_1: R204.1 ; port SPI_MCU_CH1.SPI_NCS
NetR205_1: R205.1 R207.1 ; port I2C_MCU_CH2.MCU_SCL
NetR206_1: R206.1 R208.1 ; port I2C_MCU_CH2.MCU_SDA

Not connected (* = marked no-connect by the designer): U1 11(PF1)* 12(PF2)* 22(PF10)* 47(PB1)* 49(PF11)* 50(PF12)* 53(PF13)* 54(PF14)* 55(PF15)* 56(PG0)* 57(PG1)* 58(PE7)* 59(PE8)* 60(PE9)* 63(PE10)* 66(PE13)* 68(PE15)* 75(PB14)* 98(PC8)* 101(PA9)* 102(PA10)* 110(PA15(JTDI)) 113(PC12)* 118(PD4) 123(PD7)* 128(PG13)* 129(PG14)* 132(PG15)*

### Layout directives
differential pair; differential pair class USB_DIFF_PAIR: USB_D_P
differential pair: USB_D_N

### Notes on the sheet
- From AN2867 https://www.st.com/resource/en/application_note/an2867-guidelines-for-oscillator-design-on-stm8afals-and-stm32-mcusmpus-stmicroelectronics.pdf
- gmcrit = 0.935 mA/V < 1mA/V
  However, only a 6.5% margin
- Decoupling Capacitors for VDD pins
- Bulk Capacitors for VDD pins
- CL1=CL2=C
  C = 2 x (CL-CS)
  C = 2 x (12 - CS)
- For poor layout and an upper limit STM recommends 10pF. This will give 4pF for C.
  CS could be less than this, online calculators suggest ~5pF which gives 14pF for C. Will go with 14pF but may need to test and adjust
- 12pF Load Capacitance
- Will need to validate safety factor with negative resistance to potentially adjust capacitance. @{"Id":"XIAQLYPO\KAVCPTAB","ObjectType":2} added for now, which will need to test different resistors to get this safety factor.
- Will need to measure the current through the oscillator to validate this
- gmcrit = 4 x ESR x (2 x pi x F)^2 x (C0 + CL)^2
  = 4 x 80 x (2 x pi x 16M)^2 x (5p + 12p)^2
  = 0.935 mA/V
- @{"Id":"XIAQLYPO\SCOEYYUG","ObjectType":2} to be used if @{"Id":"XIAQLYPO\TWCLBDON","ObjectType":2} is causing issues for VREF+/VDDA
- Flash
- @{"Id":"XIAQLYPO\GFEIXQVP","ObjectType":2} is for decoupling of VDDUSB, @{"Id":"XIAQLYPO\MKQIBDYT","ObjectType":2} and @{"Id":"XIAQLYPO\EJUTOMWZ","ObjectType":2} are for decoupling VDDA/VREF+ with VSSA
- Pull Up Resistor ensures UART is in idle state by default
- (near R154) 2.2k pullups on MCU side should be good for both 100khz and 400khz modes
- (near R197) 33 Ohm resistor chosen to improve signal integrity and protect MCU
- Power Monitoring
- Digital Inputs
- PWM
- Red LED with 2.3-1.7V forward voltage.
  (3.3-1.7)/470 = 3.4mA
  (3.3-2.3)/470 = 2.1mA
  LED tested at 5mA so will be dimmer than tested value
- User Controlled LEDs
- Blue LED with 2.65 to 3.05V forward voltage.
  (3.3-2.65)/180 = 3.6mA
  (3.3-3.05)/180 = 1.4mA
  LED tested at 5mA so will be dimmer than tested value
- Worst Case LED Power Draw from MCU:
  6*3.4mA + 6*3.6mA = 42mA
- Digital Outputs
- USB
- Analogue Inputs
- Analogue Output
- CAN

### Library data of the parts
C1 C2 = CMP-001-00139-1: 25V 10uF X7R ±10% 1206 Multilayer Ceramic Capacitors MLCC - SMD/SMT ROHS; Manufacturer Lifecycle Status: IN PRODUCTION; Min Operating Temperature: -55°C; Case/Package: 1206; Pins: 2; Voltage Rating: 25V; Max Operating Temperature: 125°C; Tolerance: 10%; Mounting Technology: Surface Mount; Case Code (Imperial): 1206; Case Code (Metric): 3216; China RoHS: Compliant; Depth: 1.6mm; Dielectric Material: Ceramic; Dielectric: X7R; Height: 1.6mm; Lead Free: Lead Free; Length: 3.2mm; Lifecycle Status: Production; Material: Ceramic; Number of Terminals: 2; Packaging: Cut Tape; Radiation Hardening: No; REACH SVHC: Yes; RoHS: Compliant; Schedule B: 8532240020, 8532240020; Termination: SMD/SMT; Thickness: 1.6mm; Voltage Rating (DC): 25V; Voltage: 25V; Width: 1.6mm
C3-C16 C23 = CMP-001-00136-1: 10V 100nF X7R ±10% 0402 Multilayer Ceramic Capacitors MLCC - SMD/SMT ROHS; Manufacturer Lifecycle Status: NRND; Dissipation Factor: 0.035%; Tolerance: 10%; Mounting Technology: Surface Mount; Voltage Rating: 10V; Max Operating Temperature: 125°C; Pins: 2; Case/Package: 0402; Min Operating Temperature: -55°C; Case Code (Imperial): 0402; Case Code (Metric): 1005; Country of Origin: Japan, Mainland China, Philippines, Singapore, Thailand; Depth: 500µm; Dielectric Material: Ceramic; Dielectric: X7R; Export Control Classification Number (ECCN) Code: EAR99; Harmonized Tariff Schedule (HTS) Code: 8532.24.00.20; Height: 500µm; Introduction Date: 2004-11-19; Lead Free: Lead Free; Length: 1mm; Lifecycle Status: NRND; Material: Ceramic; Number of Terminals: 2; Packaging: Cut Tape; Radiation Hardening: No; REACH SVHC: Yes; RoHS: Compliant; Schedule B: 8532240020, 8532240020; Termination: SMD/SMT; Thickness: 500µm; Voltage Rating (DC): 10V; Voltage: 10V; Width: 500µm
C17 = CMP-001-00149-1: 50V 4.7uF X7R ±10% 0805 Multilayer Ceramic Capacitors MLCC - SMD/SMT ROHS; Manufacturer Lifecycle Status: IN PRODUCTION; Case/Package: 0805; Tolerance: 10%; Voltage Rating: 50V; Min Operating Temperature: -55°C; Mounting Technology: Surface Mount; Max Operating Temperature: 125°C; Country of Origin: Japan, Mainland China, Philippines, Singapore, Thailand; Dielectric Material: Ceramic; Export Control Classification Number (ECCN) Code: EAR99; Harmonized Tariff Schedule (HTS) Code: 8532.24.00.20; Height: 1.25mm; Introduction Date: 2017-02-22; Length: 2mm; Lifecycle Status: Production; Material: Ceramic; Number of Terminals: 2; REACH SVHC: Yes; RoHS: Compliant; Thickness: 1.25mm; Voltage Rating (DC): 50V; Width: 1.25mm
C18 C19 = CMP-001-00145-1: GJM Series 0402 14 pF 50 V ±1 % Tolerance C0G SMT Monolithic Ceramic Capacitor; Manufacturer Lifecycle Status: IN PRODUCTION; Tolerance: 1%; Temperature Coefficient: 30ppm/°C; Voltage Rating: 50V; Mounting Technology: Surface Mount; RoHS: Compliant; Case/Package: 0402; Length: 1mm; Dielectric Material: Ceramic; Thickness: 500µm; Min Operating Temperature: -55°C; Max Operating Temperature: 125°C; Height: 500µm; Voltage Rating (DC): 50V; Material: Ceramic; Number of Terminals: 2; Width: 500µm; REACH SVHC: Yes; Lifecycle Status: Production
C20 C21 = CMP-001-00005-6: Chip Capacitor, 1 uF, +/- 10%, 25 V, 0603 (1608 Metric); Capacitor Type: Ceramic; Voltage Rating: 25V; Pins: 2; Mounting Technology: SM; RoHS Compliant: True; Max Operating Temperature: 125°C; Case/Package: 0603; Min Operating Temperature: -55°C; Tolerance: 10%
C22 = CMP-001-00069-3: Chip Capacitor, 10nF +/-20%, 50V, 0402, Thickness 0.6 mm; Tolerance: 5%; Max Operating Temperature: 85°C; Pins: 2; Case/Package: 0402; Voltage Rating: 50V; Min Operating Temperature: -55°C; Mounting Technology: SMT
C24 C25 = CMP-001-00146-1: 10V 2.2uF X5R ±10% 0402 Multilayer Ceramic Capacitors MLCC - SMD/SMT ROHS; Temperature Coefficient: 30ppm/°C; Voltage Rating: 10V; Depth: 500µm; Material: Ceramic; RoHS: Compliant; Weight: 652.039032µg; REACH SVHC: Yes; Height: 500µm; Halogen Free: Halogen Free; Case Code (Metric): 1005; Dielectric: X5R; Schedule B: 8532240020, 8532240020; Thickness: 558.8µm; Case/Package: 0402; Max Operating Temperature: 85°C; Mounting Technology: Surface Mount; Voltage Rating (DC): 10V; Length: 1mm; Min Operating Temperature: -55°C; Tolerance: 10%; Case Code (Imperial): 0402; Lead Free: Lead Free; Number of Terminals: 2; China RoHS: Compliant; Width: 500µm; Packaging: Tape & Reel (TR); Composition: Ceramic; Lifecycle Status: Production; Termination: SMD/SMT; Dielectric Material: Ceramic
FB1 = CMP-006-00025-1: Ferrite Beads Multi-Layer 120Ohm 25% 100MHz 500mA 250mOhm DCR 0402 Paper T/R; Max Current Rating: 500mA; Tolerance: 25%; Min Operating Temperature: -55°C; Current Rating: 500mA; Max Operating Temperature: 125°C; Case/Package: 0402; Mounting Technology: Surface Mount
R1 = CMP-009-00006-5: Chip Resistor, 0 Ohm, 0.1 W, -55 to 155 degC, 0603 (1608 Metric); Power: 100mW; Voltage Rating: 50V; Max Operating Temperature: 155°C; RoHS Compliant: True; Mounting Technology: SM; Case/Package: 0603; Min Operating Temperature: -55°C; Tolerance: 5%; Pins: 2
R2 = CMP-009-00197-1: Zero Ohm Resistor, Jumper, 0402 [1005 Metric], Thin Film, 100 mW, 630 mA, Surface Mount Device; Voltage Rating: 50V; Max Operating Temperature: 125°C; Case/Package: 0402; Min Operating Temperature: -55°C; Mounting Technology: Surface Mount
R3 R95 R99 = CMP-009-00322-1: Res Thin Film 0603 10K Ohm 0.1% 1/10W |25ppm/|C SMD Paper T/R; Voltage Rating: 75V; Max Power Dissipation: 100mW; Temperature Coefficient: 25ppm/°C; Min Operating Temperature: -55°C; Case/Package: 0603; Mounting Technology: Surface Mount; Max Operating Temperature: 155°C; Tolerance: 0.1%; Case Code (Imperial): 0603; China RoHS: Non-Compliant; Composition: Thin Film; Country of Origin: Mainland China, Taiwan; Depth: 800µm; Export Control Classification Number (ECCN) Code: EAR99; Features: Moisture Resistant; Harmonized Tariff Schedule (HTS) Code: 8533.21.00.30; Height: 450µm; Introduction Date: 2008-06-09; Lead Free: Lead Free; Length: 1.6mm; Lifecycle Status: Production; Military Standard: Not; Number of Terminals: 2; Number of Terminations: 2; Power Rating: 100mW; REACH SVHC: Yes; RoHS: Compliant; Schedule B: 8533210045, 8533210045; Termination: SMD/SMT; Voltage Rating (DC): 75V; Weight: 2.012816mg; Width: 800µm; Working Voltage: 75V
R36 R61 R66 R70 R76 R156 R158 R193-R204 R207 R208 = CMP-009-00258-1: Res Thick Film 0603 33 Ohm 1% 0.1W(1/10W) ±100ppm/C Pad SMD T/R Automotive AEC-Q200; Voltage Rating: 75V; Max Power Dissipation: 100mW; Temperature Coefficient: 100ppm/°C; Min Operating Temperature: -55°C; Tolerance: 1%; Mounting Technology: Surface Mount; Max Operating Temperature: 155°C; Case/Package: 0603; Case Code (Imperial): 0603; China RoHS: Non-Compliant; Composition: Thick Film; Country of Origin: Mainland China, Taiwan; Export Control Classification Number (ECCN) Code: EAR99; Harmonized Tariff Schedule (HTS) Code: 8533.21.00.30; Height: 450µm; Introduction Date: 2012-04-10; Length: 1.6mm; Lifecycle Status: Production; Number of Terminals: 2; Number of Terminations: 2; Power Rating: 100mW; REACH SVHC: Yes; RoHS: Compliant; Schedule B: 8533210045, 8533210045; Termination: SMD/SMT; Width: 800µm; Working Voltage: 75V; Case Code (Metric): 1608; Features: Automotive AEC-Q200, Moisture Resistant; Packaging: Tape & Reel; Power Dissipation: 100mW; Ratings: AEC-Q200
R82 R97 R154 R155 R205 R206 = CMP-009-00292-1: 100mW Thin Film Resistor 75V ±25ppm/℃ ±0.1% 2.2kΩ 0603 Chip Resistor - Surface Mount ROHS; Voltage Rating (DC): 50V; Temperature Coefficient: 25ppm/°C; Width: 800µm; Case/Package: 0603; Lead Free: Lead Free; Voltage Rating: 75V; Max Operating Temperature: 155°C; Min Operating Temperature: -55°C; Lifecycle Status: Production; RoHS: Compliant; Schedule B: 8533210045, 8533210045; Contact Plating: Lead, Tin; Military Standard: Not; REACH SVHC: Yes; Tolerance: 0.1%; Power Rating: 100mW; Number of Terminals: 2; Height: 450µm; Length: 1.6mm; Max Power Dissipation: 100mW; Composition: Thin Film; Depth: 800µm; Number of Terminations: 2; Mounting Technology: Surface Mount; China RoHS: Non-Compliant; Features: Moisture Resistant; Case Code (Imperial): 0603; Termination: SMD/SMT; Working Voltage: 75V
SW1 = CMP-033-000002-3: Toggle Switches Plugin RoHS; Manufacturer_Name: Korean Hroparts Elec; Manufacturer_Part_Number: SS-12F44-G5; Datasheet Link: https://datasheet.lcsc.com/szlcsc/Korean-Hroparts-Elec-SS-12F44-G5_C136718.pdf; Source: MAX17643ATC+.SchLib; Height: 11mm; Design Item ID: SS-12F44-G5
SW2 = CMP-011-00022-1: Switch Tactile ON OFF SPST Round Button J-Bend 0.02A 15VDC 3.5N SMD Embossed T/R; Switch Travel: 250µm; Number of Poles: 1; Contact Resistance: 100mΩ; Current Rating: 20mA; Illumination Type: Illuminated, Non-Illuminated; Switch Function: Off-Mom; Max Voltage Rating (DC): 15V; Actuator Length: 1.3mm; Mechanical Life: 100kcycles; Voltage Rating (AC): 250V; Thickness: 1.8mm; Length: 6.5mm; Throw Configuration: SPST; Number of Positions: 1; Mounting Technology: Surface Mount; Color: White; Depth: 6.6mm; REACH SVHC: Yes; Max Operating Temperature: 85°C; Export Control Classification Number (ECCN) Code: EAR99; Insulation Resistance: 100MΩ; Introduction Date: 2006-02-25; Case/Package: SMD/SMT; Min Operating Temperature: -40°C; Voltage Rating (DC): 15V; Lead Free: Lead Free; Harmonized Tariff Schedule (HTS) Code: 8536.50.90.40; Operating Force: 3.5N; RoHS: Compliant; Width: 6mm; Country of Origin: Japan, Mainland China; Lifecycle Status: Production; Height: 1.8mm; Contact Current Rating: 20mA; Electrical Life: 100kcycles; Termination: Solder; Max Current Rating: 20mA; Radiation Hardening: No
TP1 TP2 TP58-TP61 TP105-TP108 TP114 TP115 = CMP-00028-00002-2: 0.6mm round; Pins: 1
U1 = CMP-031-00008-1: Mcu, 32 Bit, CORTEX-M4, 180MHZ, LQFP-144; Max Supply Voltage: 3.6V; Min Supply Voltage: 1.7V; Number of I/Os: 114; Memory Size: 512kB; RAM Size: 128kB; REACH SVHC: No; Case/Package: LQFP; Pins: 144; Frequency: 180MHz
Y1 = CMP-003-00040-1: Crystal or Oscillator; Manufacturer_Name: ECS; Height: 0.8mm; Design Item ID: ECS-160-12-33-AGN-TR3; Arrow Price/Stock: https://www.arrow.com/en/products/ecs-160-12-33-agn-tr3/ecs-international?utm_currency=USD&region=nac; Manufacturer_Part_Number: ECS-160-12-33-AGN-TR3; Source: MAX17643ATC+.SchLib; Mouser Part Number: 520-160-12-33AGN-TR3; Arrow Part Number: ECS-160-12-33-AGN-TR3; Datasheet Link: https://ecsxtal.com/store/pdf/ecx-32.pdf; Mouser Price/Stock: https://www.mouser.co.uk/ProductDetail/ECS/ECS-160-12-33-AGN-TR3?qs=e8oIoAS2J1R5dXUdgVaN0g%3D%3D

## Sheet  PWM_CAPTURE_VREF.SchDoc
size A4; SheetNumber: 8; SheetTotal: 29
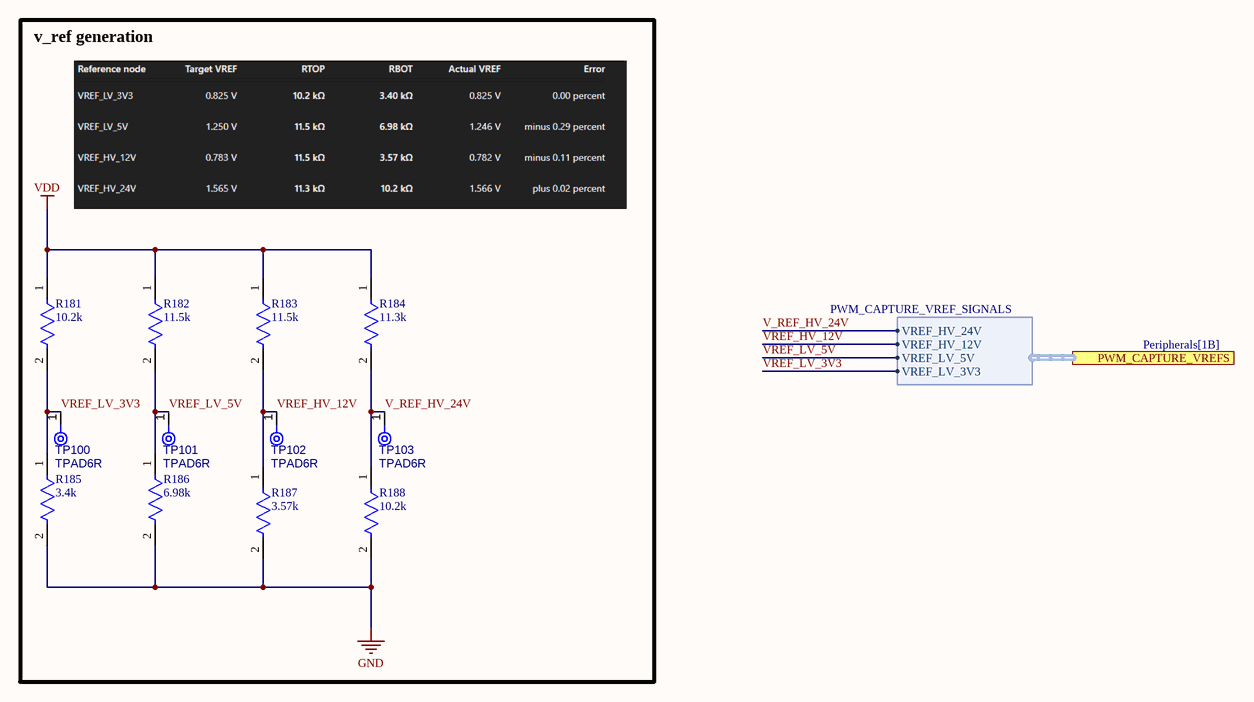
[diagram p3:  PWM_CAPTURE_VREF.SchDoc]

### Parts
R181  value 10.2k  [FP-RT0805-MFG]  (hidden comment: RT0805BRD0710K2L)
R182  value 11.5k  [FP-RT0603-IPC_C]  (hidden comment: RT0603BRD0711K5L)
R183  value 11.5k  [FP-RT0603-IPC_C]  (hidden comment: RT0603BRD0711K5L)
R184  value 11.3k  [FP-RT0603-IPC_C]  (hidden comment: RT0603BRD0711K3L)
R185  value 3.4k  [FP-RT0603-IPC_C]  (hidden comment: RT0603BRD073K4L)
R186  value 6.98k  [FP-RT0603-IPC_C]  (hidden comment: RT0603BRD076K98L)
R187  value 3.57k  [FP-RT0603-IPC_C]  (hidden comment: RT0603BRD073K57L)
R188  value 10.2k  [FP-RT0805-MFG]  (hidden comment: RT0805BRD0710K2L)
TP100  TPAD6R  [TP06R]  (no BOM)
TP101  TPAD6R  [TP06R]  (no BOM)
TP102  TPAD6R  [TP06R]  (no BOM)
TP103  TPAD6R  [TP06R]  (no BOM)

### Blocks framed on the sheet
v_ref generation: R181-R188 TP100-TP103

### Ports
PWM_CAPTURE_VREFS (harness PWM_CAPTURE_VREF_SIGNALS, see Peripherals[1B])

### Harnesses
PWM_CAPTURE_VREF_SIGNALS: VREF_LV_3V3, VREF_LV_5V, VREF_HV_12V, VREF_HV_24V

### Nets
GND: R185.2 R186.2 R187.2 R188.2
VDD: R181.1 R182.1 R183.1 R184.1
V_REF_HV_24V: R184.2 R188.1 TP103.1(TP) ; port PWM_CAPTURE_VREFS.VREF_HV_24V
VREF_HV_12V: R183.2 R187.1 TP102.1(TP) ; port PWM_CAPTURE_VREFS.VREF_HV_12V
VREF_LV_3V3: R181.2 R185.1 TP100.1(TP) ; port PWM_CAPTURE_VREFS.VREF_LV_3V3
VREF_LV_5V: R182.2 R186.1 TP101.1(TP) ; port PWM_CAPTURE_VREFS.VREF_LV_5V

### Library data of the parts
R181 R188 = CMP-009-00340-1: 125mW Thin Film Resistor ±25ppm/℃ ±0.1% 10.2kΩ 0805 Chip Resistor - Surface Mount ROHS; Manufacturer Package Identifier: 0805 (2012 metric); Voltage Rating: 150V; Temperature Coefficient: 25ppm/°C; Composition: Thin Film; Max Operating Temperature: 155°C; Case/Package: 0805; Min Operating Temperature: -55°C; Harmonized Tariff Schedule (HTS) Code: 8533.21.00.30; Termination: SMD/SMT; Height: 500µm; Width: 1.25mm; Schedule B: 8533210045, 8533210045; Number of Terminations: 2; REACH SVHC: Yes; Lifecycle Status: Production; RoHS: Compliant; Max Power Dissipation: 125mW; Mounting Technology: Surface Mount; Length: 2mm; Number of Terminals: 2; Power Rating: 125mW; Voltage Rating (DC): 150V; Country of Origin: Mainland China, Taiwan; Introduction Date: 2008-06-09; China RoHS: Non-Compliant; Tolerance: 0.1%; Working Voltage: 150V; Lead Free: Lead Free; Case Code (Imperial): 0805; Export Control Classification Number (ECCN) Code: EAR99; Weight: 5.499807mg
R182 R183 = CMP-009-00263-1: 100mW Thin Film Resistor 75V ±25ppm/℃ ±0.1% 11.5kΩ 0603 Chip Resistor - Surface Mount ROHS; Temperature Coefficient: 25ppm/°C; Harmonized Tariff Schedule (HTS) Code: 8533.21.00.30; Length: 1.6mm; Working Voltage: 75V; Termination: SMD/SMT; REACH SVHC: Yes; Lead Free: Lead Free; Depth: 800µm; Tolerance: 0.1%; Military Standard: Not; Lifecycle Status: Production; Number of Terminals: 2; Power Rating: 100mW; Introduction Date: 2008-06-09; Schedule B: 8533210045, 8533210045; China RoHS: Non-Compliant; Max Power Dissipation: 100mW; Number of Terminations: 2; Height: 450µm; Case/Package: 0603; Country of Origin: Mainland China, Taiwan; Weight: 2.012816mg; Case Code (Imperial): 0603; Voltage Rating: 75V; RoHS: Compliant; Mounting Technology: Surface Mount; Voltage Rating (DC): 75V; Width: 800µm; Min Operating Temperature: -55°C; Composition: Thin Film; Export Control Classification Number (ECCN) Code: EAR99; Features: Moisture Resistant; Max Operating Temperature: 155°C
R184 = CMP-009-00337-1: 100mW Thin Film Resistor 75V ±25ppm/℃ ±0.1% 11.3kΩ 0603 Chip Resistor - Surface Mount ROHS; Temperature Coefficient: 25ppm/°C; Tolerance: 0.1%; Width: 800µm; Mounting Technology: Surface Mount; Length: 1.6mm; REACH SVHC: Yes; Voltage Rating: 75V; Power Rating: 100mW; Min Operating Temperature: -55°C; RoHS: Compliant; Case/Package: 0603; Termination: SMD/SMT; China RoHS: Non-Compliant; Working Voltage: 75V; Max Operating Temperature: 155°C; Composition: Thin Film; Height: 450µm; Max Power Dissipation: 100mW; Number of Terminations: 2; Lead Free: Lead Free; Number of Terminals: 2; Military Standard: Not; Voltage Rating (DC): 75V; Case Code (Imperial): 0603; Depth: 800µm; Lifecycle Status: Production
R185 = CMP-009-00277-1: Res Thin Film 0603 3.4K Ohm 0.1% 0.1W(1/10W) ±25ppm/C Pad SMD T/R; Voltage Rating (DC): 50V; Voltage Rating: 75V; Power Rating: 100mW; Temperature Coefficient: 25ppm/°C; Features: Moisture Resistant; Contact Plating: Tin; Number of Terminations: 2; Introduction Date: 2008-06-09; Tolerance: 0.1%; Number of Terminals: 2; China RoHS: Non-Compliant; Mounting Technology: Surface Mount; Lead Free: Lead Free; Case Code (Imperial): 0603; Lifecycle Status: Production; Height: 450µm; Termination: SMD/SMT; REACH SVHC: Yes; Width: 800µm; Weight: 2.012816mg; Harmonized Tariff Schedule (HTS) Code: 8533.21.00.30; Composition: Thin Film; Max Power Dissipation: 100mW; RoHS: Compliant; Depth: 800µm; Case/Package: 0603; Min Operating Temperature: -55°C; Schedule B: 8533210045, 8533210045; Military Standard: Not; Length: 1.6mm; Max Operating Temperature: 155°C; Radiation Hardening: No; Country of Origin: Mainland China, Taiwan; Working Voltage: 75V; Export Control Classification Number (ECCN) Code: EAR99
R186 = CMP-009-00270-1: 100mW Thin Film Resistor ±25ppm/℃ ±0.1% 6.98kΩ 0603 Chip Resistor - Surface Mount ROHS; Temperature Coefficient: 25ppm/°C; Working Voltage: 75V; Voltage Rating (DC): 50V; China RoHS: Non-Compliant; REACH SVHC: Yes; Termination: SMD/SMT; Lifecycle Status: Production; Number of Terminations: 2; Width: 800µm; Power Rating: 100mW; Length: 1.6mm; Max Power Dissipation: 100mW; RoHS: Compliant; Height: 450µm; Tolerance: 0.1%; Voltage Rating: 75V; Schedule B: 8533210045, 8533210045; Min Operating Temperature: -55°C; Lead Free: Lead Free; Case/Package: 0603; Mounting Technology: Surface Mount; Features: Moisture Resistant; Composition: Thin Film; Case Code (Imperial): 0603; Number of Terminals: 2; Max Operating Temperature: 155°C
R187 = CMP-009-00278-1: 100mW Thin Film Resistor ±25ppm/℃ ±0.1% 3.57kΩ 0603 Chip Resistor - Surface Mount ROHS; Working Voltage: 75V; Voltage Rating (DC): 50V; Temperature Coefficient: 25ppm/°C; Tolerance: 0.1%; Termination: SMD/SMT; Composition: Thin Film; Min Operating Temperature: -55°C; Width: 800µm; Height: 450µm; Harmonized Tariff Schedule (HTS) Code: 8533.21.00.30; Case/Package: 0603; Schedule B: 8533210045, 8533210045; Max Operating Temperature: 155°C; China RoHS: Non-Compliant; Country of Origin: Mainland China, Taiwan; Number of Terminations: 2; Export Control Classification Number (ECCN) Code: EAR99; Length: 1.6mm; Power Rating: 100mW; Case Code (Imperial): 0603; Depth: 800µm; REACH SVHC: Yes; Military Standard: Not; Voltage Rating: 75V; Weight: 2.012816mg; Mounting Technology: Surface Mount; Lead Free: Lead Free; Lifecycle Status: Production; Introduction Date: 2008-06-09; Max Power Dissipation: 100mW; RoHS: Compliant; Features: Moisture Resistant; Number of Terminals: 2
TP100-TP103 = CMP-00028-00002-2: 0.6mm round; Pins: 1